# EAGLE design Buksir (EAGLE 9.4.2)
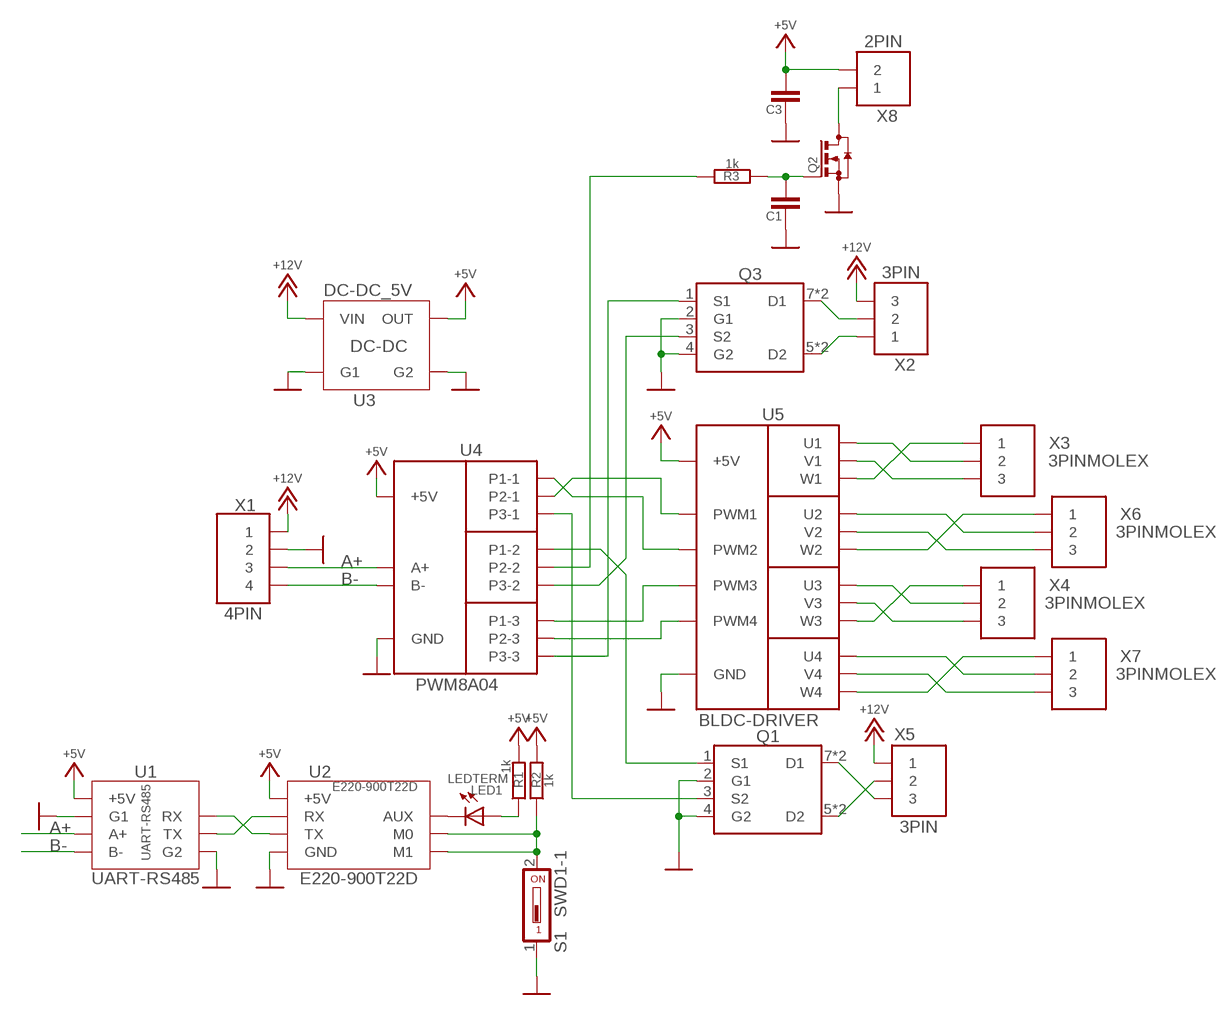
[diagram p0: schematic, sheet 1]

## Parts
C1  CAPACITOR1206  [C1206]
C3  CAPACITOR1206  [C1206]
LED1  LEDTERM  [LED_TERM]
Q1  NCV8402ADDR2G  [SOIC-8]
Q2  FET-N  [SOT23]
Q3  NCV8402ADDR2G  [SOIC-8]
R1  1k  RESISTOR0805  [R0805]
R2  1k  RESISTOR0805  [R0805]
R3  1k  RESISTOR0805  [R0805]
S1  SWD1-1  DS01  [DS-01]
U1  UART-RS485  [UART-RS485]
U2  E220-900T22D  [E220-900T22D]
U3  DC-DC_5V  [DC-DC_5V]
U4  PWM8A04  [PWM8A04]
U5  BLDC-DRIVER  [BLDC-DRIVER]
X1  4PIN  [4PIN-2.5MM]
X2  3PIN  [3PIN-2.5MM]
X3  3PINMOLEX  [3PIN-MOLEX]
X4  3PINMOLEX  [3PIN-MOLEX]
X5  3PIN  [3PIN-2.5MM]
X6  3PINMOLEX  [3PIN-MOLEX]
X7  3PINMOLEX  [3PIN-MOLEX]
X8  2PIN  [2PIN-2.5MM]

## Nets
+5V: C3.2 R1.2 R2.2 U1.VCC(+5V) U2.VCC(+5V) U3.OUT U4.+V(+5V) U5.B+(+5V) X8.P$2
A+: U1.A+ U4.A+ X1.P$2
B-: U1.B- U4.B- X1.P$1
GND: C1.1 C3.1 Q1.2(G1) Q1.4(G2) Q2.2(S) Q3.2(G1) Q3.4(G2) S1.1 U1.G1 U1.G2 U2.GND U3.G1 U3.G2 U4.GND U5.B-(GND) X1.P$3
N$1: U1.TX U2.RXD(RX)
N$2: U1.RX U2.TXD(TX)
N$3: LED1.K(C) U2.AUX
N$4: LED1.A R1.1
N$5: R2.1 S1.2 U2.M0 U2.M1
N$6: Q3.7(D1) Q3.8(D1) X2.P$2
N$7: Q3.5(D2) Q3.6(D2) X2.P$1
N$8: Q1.5(D2) Q1.6(D2) X5.P$2
N$9: U4.P2-3 U5.PWM4
N$10: Q1.7(D1) Q1.8(D1) X5.P$3
N$11: U4.P1-3 U5.PWM3
N$12: U4.P1-1 U5.PWM2
N$13: U5.U1 X3.P$2
N$14: U5.V1 X3.P$3
N$15: U5.W1 X3.P$1
N$16: U5.W2 X6.P$1
N$17: U5.V2 X6.P$3
N$18: U5.U2 X6.P$2
N$19: U5.U3 X4.P$2
N$20: U5.V3 X4.P$3
N$21: U5.W3 X4.P$1
N$22: U5.U4 X7.P$2
N$23: U5.V4 X7.P$3
N$24: U5.W4 X7.P$1
N$25: U4.P2-1 U5.PWM1
N$26: Q2.3(D) X8.P$1
N$27: C1.2 Q2.1(G) R3.1
N$28: R3.2 U4.P2-2
P1-2: Q1.1(S1) U4.P1-2
P3-1: Q1.3(S2) U4.P3-1
P3-2: Q3.3(S2) U4.P3-2
P3-3: Q3.1(S1) U4.P3-3
V_IN: U3.VIN X1.P$4 X2.P$3 X5.P$1 ; supply symbol labelled +12V

## Library data of the parts
C1 C3 = !!!WirenBoard:CAPACITOR
LED1 = !!!WirenBoard:LED
Q1 Q3 = !WB_IC:NCV8402ADDR2G
Q2 = !!!WirenBoard:FET-N
R1-R3 = !!!WirenBoard:RESISTOR: C17471
S1 = switch-dil:DS01: DIL/CODE SWITCH; OC_FARNELL: unknown; OC_NEWARK: unknown
U1 = buksir:UART-RS485
U2 = buksir:E220-900T22D
U3 = buksir:DC-DC_5V
U4 = buksir:PWM8A04
U5 = buksir:BLDC-DRIVER
X1 = buksir:4PIN
X2-X7 = buksir:3PIN
X8 = buksir:2PIN

## Board
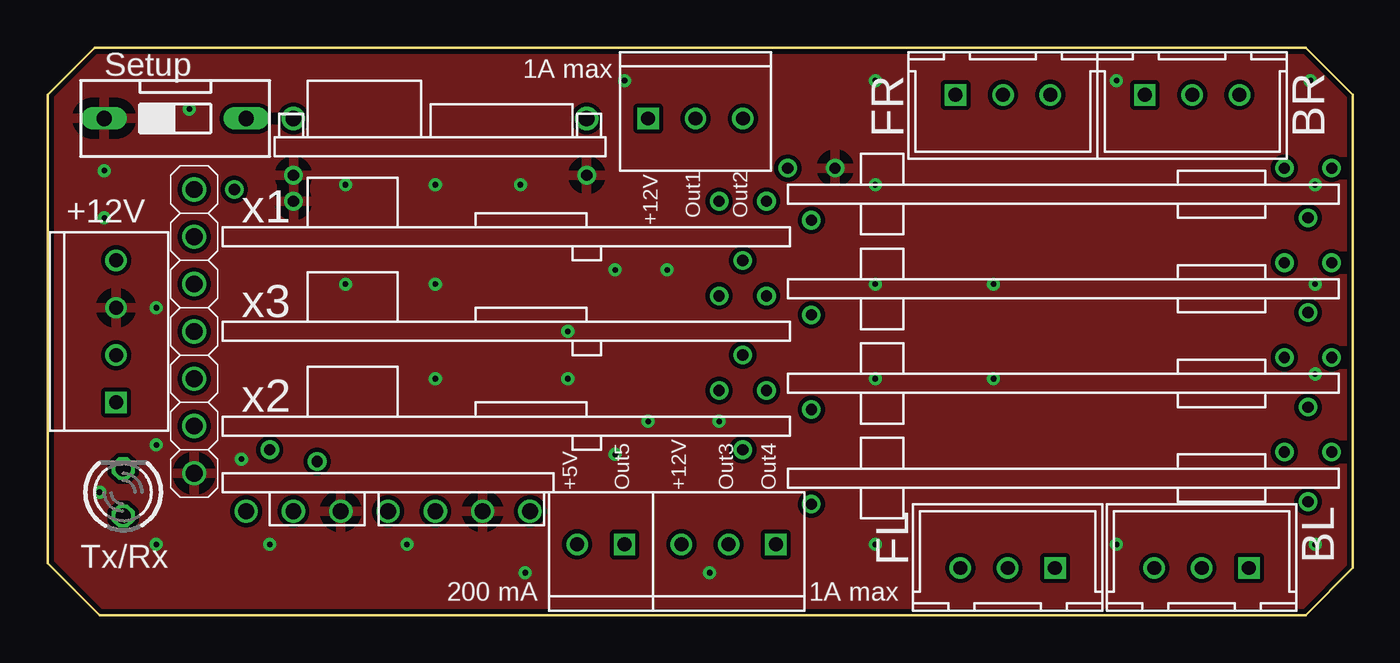
[diagram p1: board, top side]
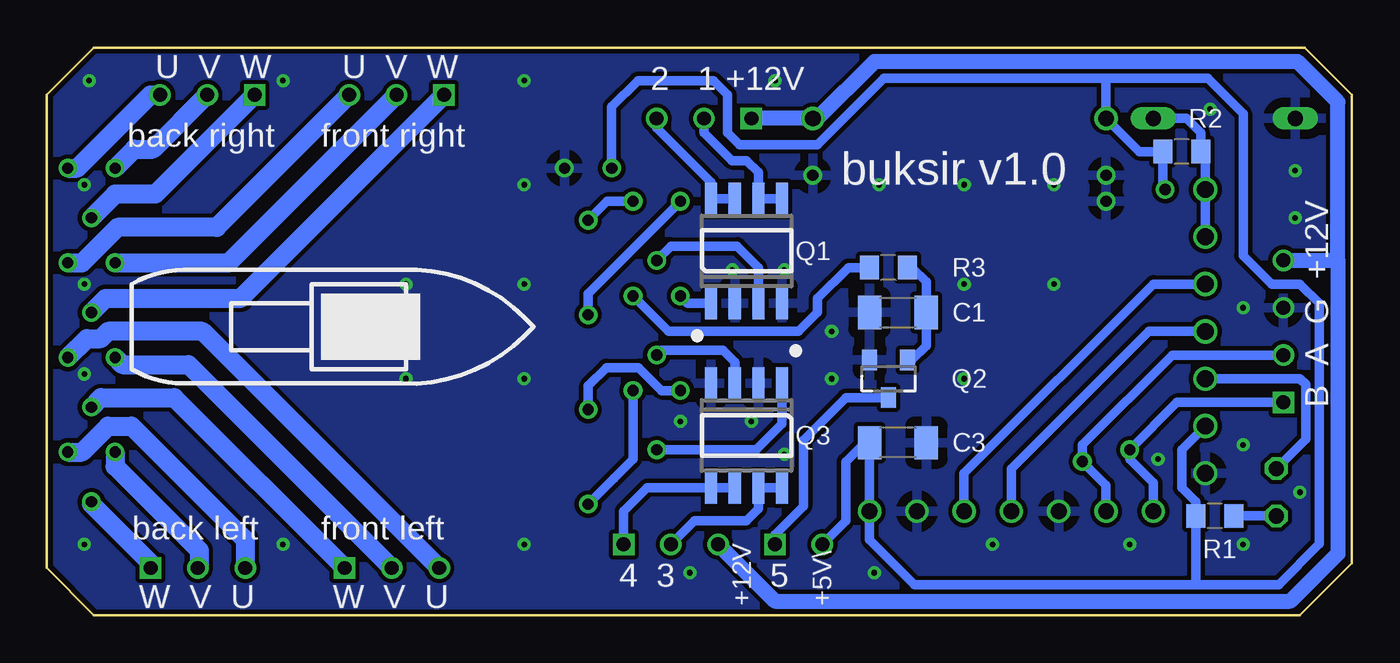
[diagram p2: board, bottom side, seen from below]

Size 70.1 x 30.48 mm. Coordinates in mm from the lower left corner, seen from the top.
Outline: 0,27.94 0,2.79 2.79,0 67.56,0 70.1,2.54 70.1,27.94 67.56,30.48 2.54,30.48 0,27.94
Copper layers (1*16): Top 0.035mm / dielectric 0.2mm / Bottom 0.035mm
Design rules "WB-2l-35um": minimum track width 0.25mm, minimum drill 0.3mm, track to track 9mil, track to pad 9mil, pad to pad 9mil, via to via 9mil, smd to smd 9mil, copper to edge 10mil, drill to drill 10mil, minimum pad ring 0.2mm, minimum via ring 0.2mm, stop-mask expansion 0.05mm, vias tented up to drill 0.3mm, thermal gap 20mil

### Footprints (pad centres in the part's own frame; a part is rotated, then mirrored left to right if it is on the bottom)
C1206 = smd 1.27 x 1.778: 1 -1.524,0; 2 1.524,0
LED_TERM = drill 0.813 octagon: A -1.27,0; K 1.27,0
SOIC-8 = smd 0.65 x 1.75: 1 -1.905,-2.794; 2 -0.635,-2.794; 3 0.635,-2.794; 4 1.905,-2.794; 5 1.905,2.794; 6 0.635,2.794; 7 -0.635,2.794; 8 -1.905,2.794
SOT23 = smd 0.8 x 1.1: 1 -1.016,-1.016; 2 1.016,-1.016; 3 0,1.016
R0805 = smd 1.016 x 1.27: 1 -1.016,0; 2 1.016,0
DS-01 = drill 0.813 long: 1 0,-3.81; 2 0,3.81
UART-RS485 = drill 0.85: A+ 13.97,2.032; B- 16.51,2.032; G1 3.81,2.032; G2 11.43,2.032; RX 8.89,2.032; TX 6.35,2.032; VCC 1.27,2.032
E220-900T22D = drill 0.9: AUX 1.524,-2.54; GND 1.524,-7.62; M0 1.524,7.62; M1 1.524,5.08; RXD 1.524,2.54; TXD 1.524,0; VCC 1.524,-5.08
DC-DC_5V = drill 0.6: G1 1.016,1.016; G2 16.764,1.016 | drill 0.85: OUT 16.764,-2.032; VIN 1.016,-2.032
PWM8A04 = drill 0.6: +V 0.635,7.62; A+ 5.08,-6.985; B- 2.54,-6.35; GND 3.81,6.985; P1-1 26.67,6.985; P1-2 26.67,1.905; P1-3 26.67,-3.175; P2-1 29.21,6.985; P2-2 29.21,1.905; P2-3 29.21,-3.175; P3-1 27.94,3.81; P3-2 27.94,-1.27; P3-3 27.94,-6.35
BLDC-DRIVER = drill 0.6: B+ -1.27,9.017; B- 1.27,9.017; PWM1 0,6.223; PWM2 0,1.143; PWM3 0,-3.937; PWM4 0,-9.017; U1 25.4,9.017; U2 25.4,3.937; U3 25.4,-1.143; U4 25.4,-6.223; V1 27.94,9.017; V2 27.94,3.937; V3 27.94,-1.143; V4 27.94,-6.223; W1 26.67,6.35; W2 26.67,1.27; W3 26.67,-3.81; W4 26.67,-8.89
4PIN-2.5MM = drill 0.75 square: P$1 -3.81,0 | drill 0.75: P$2 -1.27,0; P$3 1.27,0; P$4 3.81,0
3PIN-2.5MM = drill 0.75 square: P$1 -2.54,0 | drill 0.75: P$2 0,0; P$3 2.54,0
3PIN-MOLEX = drill 0.75 square: P$1 -2.54,0 | drill 0.75: P$2 0,0; P$3 2.54,0
2PIN-2.5MM = drill 0.75 square: P$1 -1.27,0 | drill 0.75: P$2 1.27,0

### Placement (x,y rotation side)
C1  24.38,16.26 0 bottom
C3  24.38,9.27 180 bottom
LED1  4.06,6.6 90 top
Q1  32.51,19.56 0 bottom
Q2  24.89,12.7 180 bottom
Q3  32.51,9.65 180 bottom
R1  7.37,5.33 180 bottom
R2  9.14,24.89 180 bottom
R3  24.89,18.67 180 bottom
S1  6.86,26.67 270 top
U1  27.18,7.62 180 top
U2  6.35,15.24 0 top
U3  29.97,24.64 180 top
U4  9.4,15.24 0 top
U5  41.02,14.99 0 top
X1  3.68,15.24 90 top
X2  36.58,3.81 180 top
X3  61.47,27.94 0 top
X4  51.56,2.54 180 top
X5  34.8,26.67 0 top
X6  51.31,27.94 0 top
X7  61.98,2.54 180 top
X8  29.72,3.81 180 top

### Tracks (layer width: path | path; a pad name or v marks a point on that pad's centre or on a via)
+5V
  Bottom 0.508: 13.21,28.83 U3.OUT 11.43,24.89 R2.2 10.16,22.99 U4.+V | 13.21,28.83 7.75,28.83 5.84,26.92 5.84,19.3 4.32,17.78 2.79,17.78 1.75,16.74 1.75,3.83 3.94,1.65 8.38,1.65 | 8.38,1.65 R1.2 8.38,6.1 9.14,6.86 9.14,8.89 U2.VCC | 13.21,28.83 25.15,28.83 28.7,25.27 32.89,25.27 33.53,25.91 33.53,27.94 34.29,28.7 38.35,28.7 39.75,27.3 U5.B+ | X8.P$2 27.18,5.08 27.18,8.25 26.16,9.27 C3.2 U1.VCC 25.91,4.06 23.5,1.65 8.89,1.65 8.38,1.65
A+
  Bottom 0.508: X1.P$2 9.65,13.97 14.48,9.14 U4.A+ 13.21,6.98 U1.A+
B-
  Bottom 0.508: X1.P$1 9.4,11.43 U4.B- 11.94,8.38 10.67,7.11 U1.B-
GND  (via drill 0.3)
  other vias: 3.05,23.88 3.05,21.34 16,23.11 25.4,23.11 20.83,23.11 16,17.78 5.84,16.51 5.84,9.14 5.84,3.81 11.94,3.81 44.45,3.81 44.45,12.7 44.45,17.78 44.45,23.11 50.8,17.78 57.4,3.81 68.07,3.81 68.07,12.95 68.07,17.78 68.07,23.11 67.82,28.7 57.4,28.7 44.45,28.7 30.99,28.7 30.48,18.54 33.27,18.54 2.79,6.6 7.62,27.18 35.56,2.29 27.94,15.24 27.94,12.7 20.83,12.7 20.83,17.78 50.8,12.7 25.65,2.29 32.26,10.41 36.07,10.41 30.48,8.64 19.3,3.81 10.41,8.38
  pour Bottom: -0.51,31.24 70.61,31.24 70.61,-0.25 -0.51,-0.25
  pour Top: -0.51,31.24 70.61,31.24 70.61,-0.25 -0.51,-0.25
N$1
  Bottom 0.508: U1.TX 20.83,7.62 10.67,17.78 U2.RXD
N$2
  Bottom 0.508: U2.TXD 10.92,15.24 18.29,7.87 U1.RX
N$3
  Bottom 0.508: U2.AUX 2.79,12.7 2.49,12.39 2.49,9.45 LED1.K
N$4
  Bottom 0.508: R1.1 LED1.A
N$5
  Bottom 0.25: 8.38,24.64 R2.1
  Bottom 0.508: S1.2 8.89,26.67 8.13,25.91 R2.1 7.87,24.64 U2.M0 U2.M1
N$6
  Bottom 0.508: X2.P$2 35.31,5.08 32.51,5.08 31.88,5.71 Q3.7 Q3.8
N$7
  Bottom 0.508: X2.P$1 39.12,5.59 37.85,6.86 Q3.5 Q3.6
N$8
  Bottom 0.508: X5.P$2 34.8,25.91 33.3,24.41 32.51,24.41 31.88,23.77 Q1.6 Q1.5
N$9
  Bottom 0.508: U5.PWM4 39.62,7.37 38.61,8.38 U4.P2-3
N$10
  Bottom 0.508: X5.P$3 37.34,26.16 34.42,23.24 Q1.8 Q1.7
N$11
  Bottom 0.508: U5.PWM3 41.02,12.32 40.04,13.3 38.31,13.3 37.08,12.06 U4.P1-3
N$12
  Bottom 0.508: U4.P1-1 41.02,17.27 U5.PWM2
N$13
  Bottom 1.016: U5.U1 65.41,25.02 64.39,25.02 X3.P$2
N$14
  Bottom 1.016: U5.V1 68.45,24 64.52,27.94 X3.P$3
N$15
  Bottom 1.016: U5.W1 66.42,22.61 64.26,22.61 X3.P$1
N$16
  Bottom 1.016: U5.W2 66.93,17.02 59.69,17.02 X6.P$1
N$17
  Bottom 1.016: U5.V2 68.2,18.92 66.29,20.83 60.96,20.83 X6.P$3
N$18
  Bottom 1.016: X6.P$2 60.33,18.92 U5.U2
N$19
  Bottom 1.016: U5.U3 66.04,13.46 62.48,13.46 X4.P$2
N$20
  Bottom 1.016: X4.P$3 61.72,15.24 66.8,15.24 67.18,14.86 67.94,14.86 U5.V3
N$21
  Bottom 1.016: U5.W3 67.18,11.68 63.25,11.68 X4.P$1
N$22
  Bottom 1.016: X7.P$2 61.91,2.61 61.91,3.49 66.42,8 U5.U4
N$23
  Bottom 1.016: U5.V4 68.2,8.76 66.8,10.16 65.53,10.16 59.44,4.06 X7.P$3
N$24
  Bottom 1.016: U5.W4 67.69,5.97 64.52,2.79 X7.P$1
N$25
  Bottom 0.508: U4.P2-1 40.01,22.23 U5.PWM1
N$26
  Bottom 0.508: X8.P$1 30.99,4.32 29.46,5.84 29.46,9.4 27.18,11.68 Q2.3
N$27
  Bottom 0.508: Q2.1 23.62,13.72 22.86,14.48 C1.2 22.86,17.91 23.62,18.67 R3.1
N$28
  Bottom 0.508: U4.P2-2 36.7,15.24 29.72,15.24 28.7,16.26 28.7,17.02 27.05,18.67 R3.2
P1-2
  Bottom 0.508: U4.P1-2 35.69,16.76 Q1.1
P3-1
  Bottom 0.508: U4.P3-1 36.58,19.81 33.02,19.81 31.88,18.67 Q1.3
P3-2
  Bottom 0.508: U4.P3-2 37.08,14.22 33.78,14.22 33.15,13.59 Q3.3
P3-3
  Bottom 0.508: Q3.1 30.61,10.29 32,8.89 U4.P3-3
V_IN
  Bottom 0.813: X1.P$4 0.76,19.05 | 0.76,19.05 0.76,27.56 2.92,29.72 25.65,29.72 28.7,26.67 U3.VIN X5.P$1 | 0.76,19.05 0.76,3.3 3.3,0.76 30.99,0.76 X2.P$3

### Text on the board
tPlace: Setup | 1A max | FR | BR | +12V | x1 | +12V | Out1 | Out2 | x3 | x2 | +5V | Out5 | +12V | Out3 | Out4 | BL | Tx/Rx | 200 mA | 1A max | FL
bPlace: U V W | U V W | 2 1 +12V | front right | back right | buksir v1.0 | B A G +12V | front left | back left | 5 | 4 3 | +5V\ | +12V | W V U | W V U
bCarbon: R2 | Q1 | R3 | C1 | Q2 | C3 | Q3 | R1